# Altium schematic sheet H Bridge.SchDoc
size A4
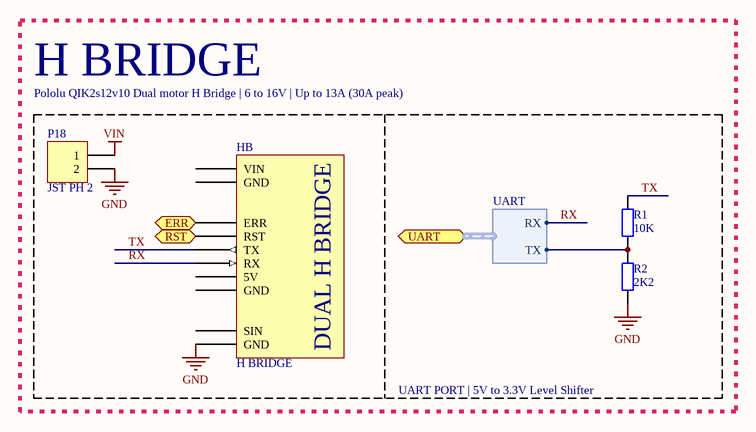
[diagram p0: H Bridge.SchDoc]

## Parts
HB  H BRIDGE  [POLOLU-QIK-2S12V10-BOTTOM]
P18  JST PH 2  [B2B-PH-K]
R1  10K  [RES1206]
R2  2K2  [RES1206]

## Blocks framed on the sheet
UART PORT | 5V to 3.3V Level Shifter: HB P18 R1 R2

## Ports
ERR (out), RST (in), UART (harness UART)

## Harnesses
UART: RX, TX

## Nets
GND: HB.GND3(GND) P18.2 R2.1
VIN: P18.1
ERR: HB.ERR ; port ERR
RST: HB.RST ; port RST
RX: HB.RX ; port UART.RX
TX: HB.TX R1.2
NetR1_1: R1.1 R2.2 ; port UART.TX

Not connected (* = marked no-connect by the designer): HB 5V GND1(GND) GND2(GND) SIN VIN

## Notes on the sheet
- H BRIDGE
- Pololu QIK2s12v10 Dual motor H Bridge | 6 to 16V | Up to 13A (30A peak)
- (in symbol POLOLU-QIK-2S12V10) DUAL H BRIDGE

## Library data of the parts
HB = POLOLU-QIK-2S12V10: POLOLU QIK 2S12V10 DUAL H BRIDGE
R1 R2 = RES